# Altium project Field_control.PrjPcb
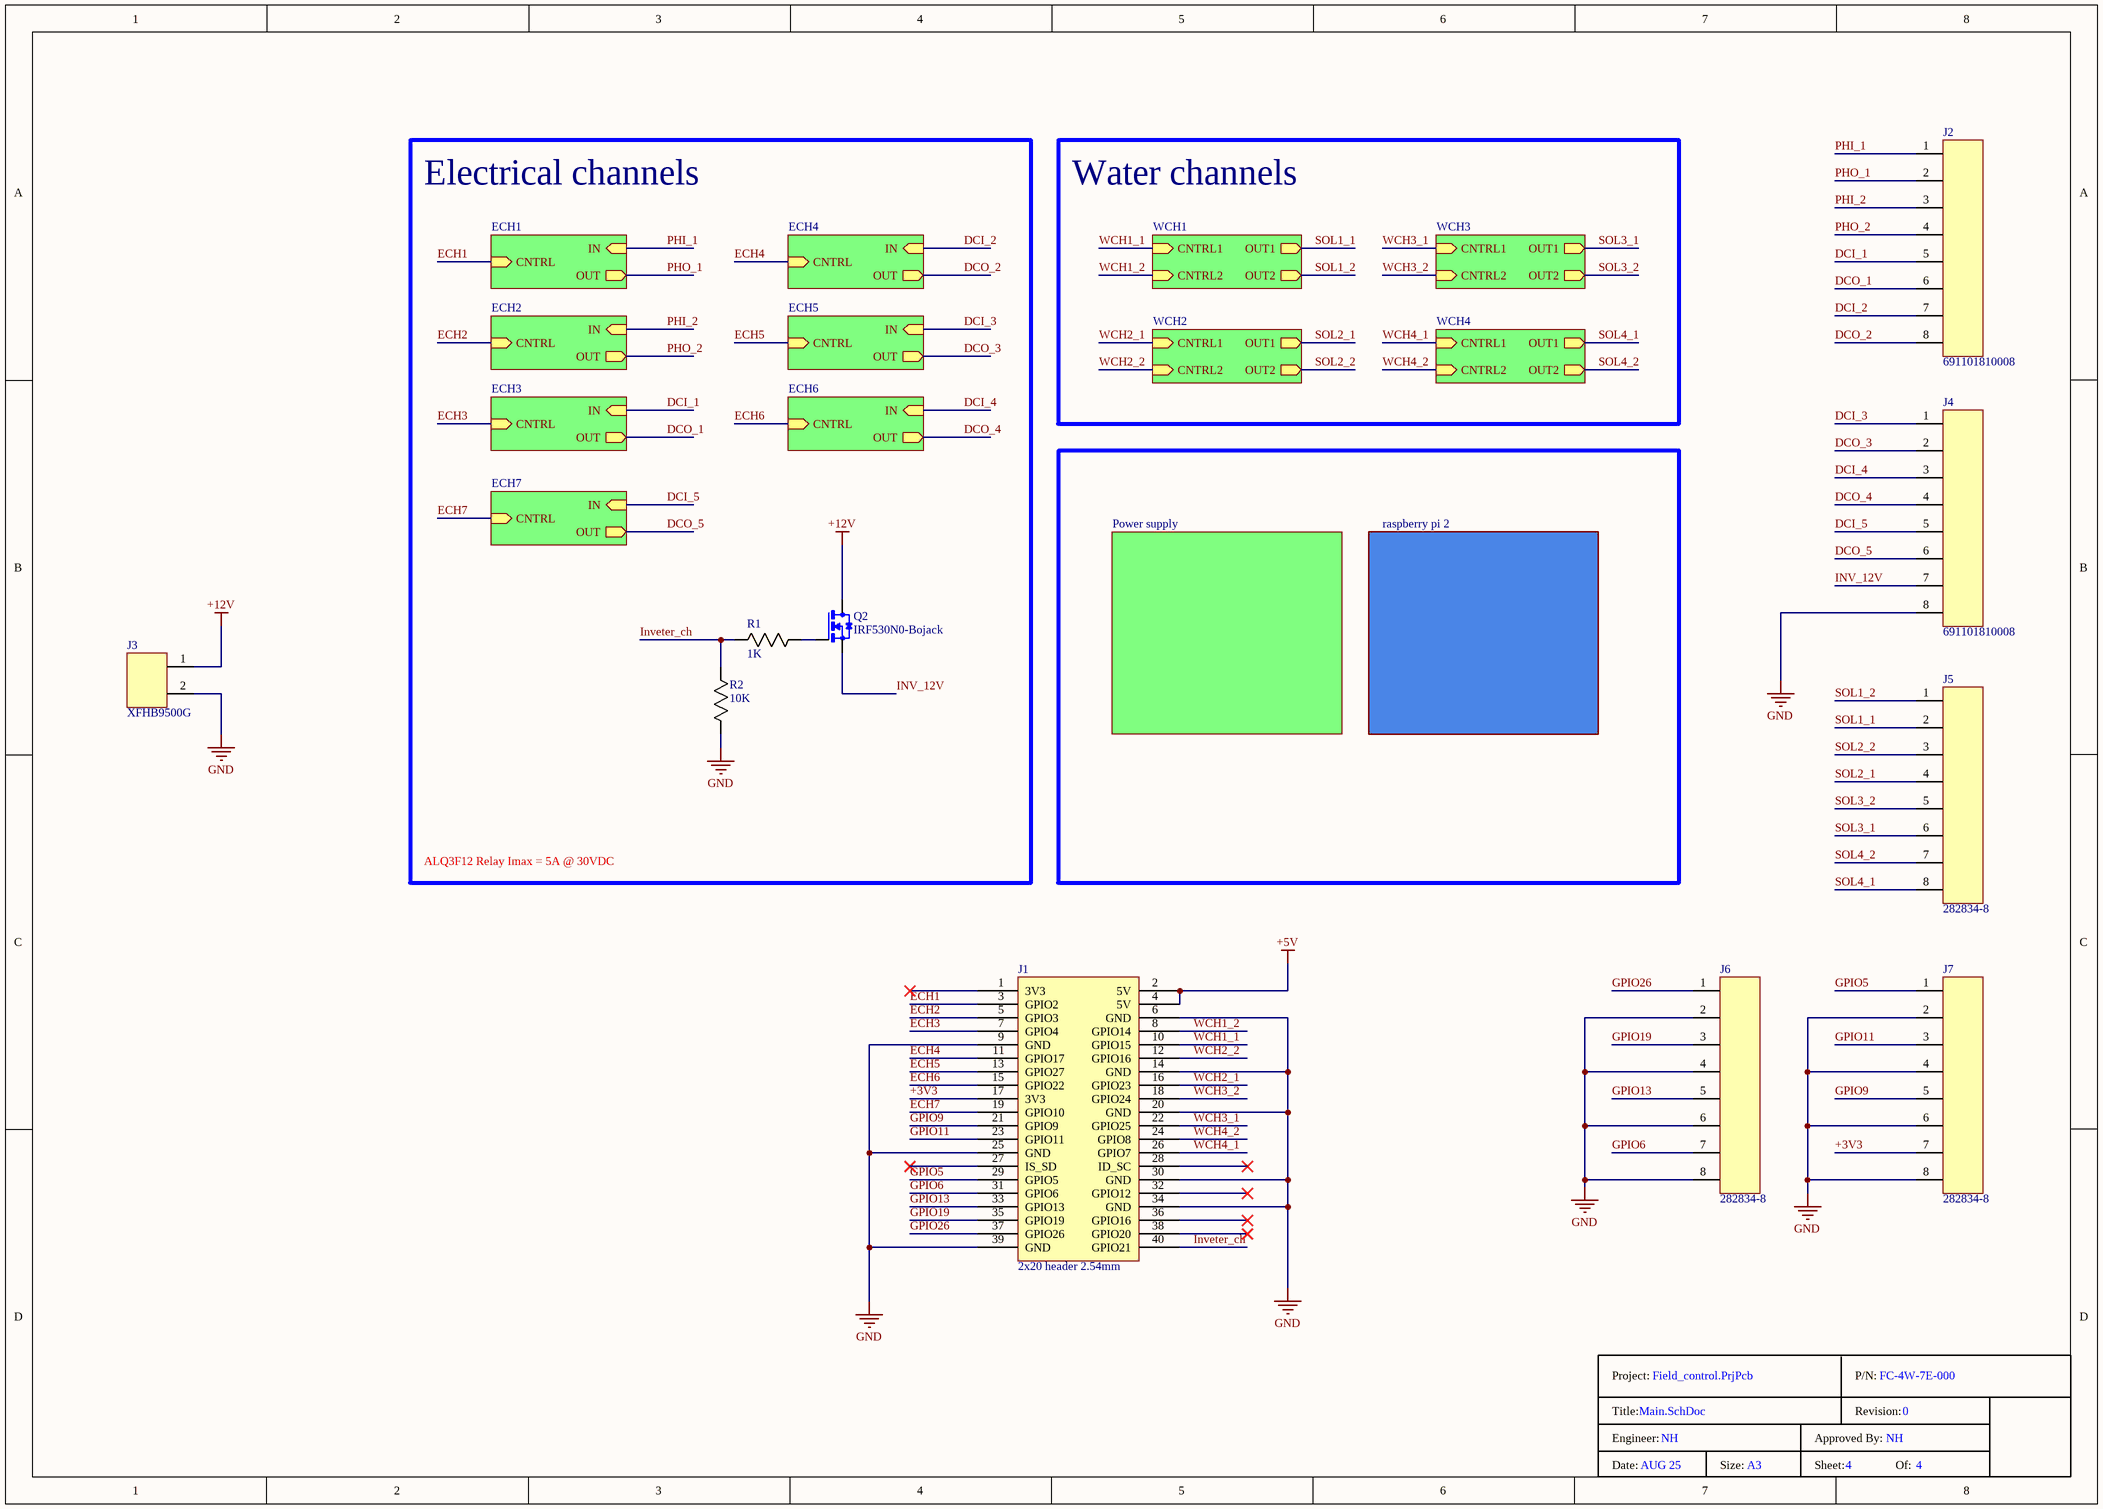
[diagram p0: Main.SchDoc]
AP: NH; PN: FC-4W-7E-000; REV: 0; SIZE: A3
4 sheets, 95 parts. Net scope: hierarchical (ports join the sheet entries above them; power ports are global).
Board file: PCB1.PcbDoc
Sheets:
  Main.SchDoc
    Power supply = PS.SchDoc
    ECH3 = Electrical Channels.SchDoc
    ECH2 = Electrical Channels.SchDoc
    ECH1 = Electrical Channels.SchDoc
    ECH4 = Electrical Channels.SchDoc
    ECH5 = Electrical Channels.SchDoc
    ECH6 = Electrical Channels.SchDoc
    WCH1 = Water Channel.SchDoc
    WCH2 = Water Channel.SchDoc
    WCH3 = Water Channel.SchDoc
    WCH4 = Water Channel.SchDoc
    ECH7 = Electrical Channels.SchDoc

## Sheet Main.SchDoc
size A3; Date: AUG 25; Engineer: NH; SheetNumber: 1; SheetTotal: 4

### Parts
(Parts that share a designator on the sheet are numbered #1, #2 ... from top to bottom, then left to right.)
*#1  Title Block  (value not drawn)  (graphical)
J1  2x20 header 2.54mm  [2x20 2.54mm header]
J2  691101810008  [691101810008]
J3  XFHB9500G  [XHFB9500G]
J4  691101810008  [691101810008]
J5  282834-8  [282834-8]
J6  282834-8  [282834-8]
J7  282834-8  [282834-8]
Q2  IRF530N0-Bojack  [SOT78(TO220AB)]
R1  1K  [R0603]
R2  10K  [R0603]
U3  raspberry pi 2  [Raspberry pi 2]  (mechanical)

### Blocks framed on the sheet
Electrical channels: Q2 R1 R2

### Sub-sheets
ECH1 = Electrical Channels.SchDoc: CNTRL (in), IN (in), OUT (out)
ECH2 = Electrical Channels.SchDoc: CNTRL (in), IN (in), OUT (out)
ECH3 = Electrical Channels.SchDoc: CNTRL (in), IN (in), OUT (out)
ECH4 = Electrical Channels.SchDoc: CNTRL (in), IN (in), OUT (out)
ECH5 = Electrical Channels.SchDoc: CNTRL (in), IN (in), OUT (out)
ECH6 = Electrical Channels.SchDoc: CNTRL (in), IN (in), OUT (out)
ECH7 = Electrical Channels.SchDoc: CNTRL (in), IN (in), OUT (out)
Power supply = PS.SchDoc: no entries
WCH1 = Water Channel.SchDoc: CNTRL1 (in), CNTRL2 (in), OUT1 (out), OUT2 (out)
WCH2 = Water Channel.SchDoc: CNTRL1 (in), CNTRL2 (in), OUT1 (out), OUT2 (out)
WCH3 = Water Channel.SchDoc: CNTRL1 (in), CNTRL2 (in), OUT1 (out), OUT2 (out)
WCH4 = Water Channel.SchDoc: CNTRL1 (in), CNTRL2 (in), OUT1 (out), OUT2 (out)

### Nets
+5V: J1.2(5V) J1.4(5V)
+12V: J3.1 Q2.3(D)
GND: J1.6(GND) J1.9(GND) J1.14(GND) J1.20(GND) J1.25(GND) J1.30(GND) J1.34(GND) J1.39(GND) J3.2 J4.8 J6.2 J6.4 J6.6 J6.8 J7.2 J7.4 J7.6 J7.8 R2.1
+3V3: J1.17(3V3) J7.7
DCI_1: J2.5 ; sheet ECH3/IN
DCI_2: J2.7 ; sheet ECH4/IN
DCI_3: J4.1 ; sheet ECH5/IN
DCI_4: J4.3 ; sheet ECH6/IN
DCI_5: J4.5 ; sheet ECH7/IN
DCO_1: J2.6 ; sheet ECH3/OUT
DCO_2: J2.8 ; sheet ECH4/OUT
DCO_3: J4.2 ; sheet ECH5/OUT
DCO_4: J4.4 ; sheet ECH6/OUT
DCO_5: J4.6 ; sheet ECH7/OUT
ECH1: J1.3(GPIO2) ; sheet ECH1/CNTRL
ECH2: J1.5(GPIO3) ; sheet ECH2/CNTRL
ECH3: J1.7(GPIO4) ; sheet ECH3/CNTRL
ECH4: J1.11(GPIO17) ; sheet ECH4/CNTRL
ECH5: J1.13(GPIO27) ; sheet ECH5/CNTRL
ECH6: J1.15(GPIO22) ; sheet ECH6/CNTRL
ECH7: J1.19(GPIO10) ; sheet ECH7/CNTRL
GPIO5: J1.29(GPIO5) J7.1
GPIO6: J1.31(GPIO6) J6.7
GPIO9: J1.21(GPIO9) J7.5
GPIO11: J1.23(GPIO11) J7.3
GPIO13: J1.33(GPIO13) J6.5
GPIO19: J1.35(GPIO19) J6.3
GPIO26: J1.37(GPIO26) J6.1
INV_12V: J4.7 Q2.2(S)
Inveter_ch: J1.40(GPIO21) R1.1 R2.2
PHI_1: J2.1 ; sheet ECH1/IN
PHI_2: J2.3 ; sheet ECH2/IN
PHO_1: J2.2 ; sheet ECH1/OUT
PHO_2: J2.4 ; sheet ECH2/OUT
SOL1_1: J5.2 ; sheet WCH1/OUT1
SOL1_2: J5.1 ; sheet WCH1/OUT2
SOL2_1: J5.4 ; sheet WCH2/OUT1
SOL2_2: J5.3 ; sheet WCH2/OUT2
SOL3_1: J5.6 ; sheet WCH3/OUT1
SOL3_2: J5.5 ; sheet WCH3/OUT2
SOL4_1: J5.8 ; sheet WCH4/OUT1
SOL4_2: J5.7 ; sheet WCH4/OUT2
WCH1_1: J1.10(GPIO15) ; sheet WCH1/CNTRL1
WCH1_2: J1.8(GPIO14) ; sheet WCH1/CNTRL2
WCH2_1: J1.16(GPIO23) ; sheet WCH2/CNTRL1
WCH2_2: J1.12(GPIO16) ; sheet WCH2/CNTRL2
WCH3_1: J1.22(GPIO25) ; sheet WCH3/CNTRL1
WCH3_2: J1.18(GPIO24) ; sheet WCH3/CNTRL2
WCH4_1: J1.26(GPIO7) ; sheet WCH4/CNTRL1
WCH4_2: J1.24(GPIO8) ; sheet WCH4/CNTRL2
NetQ2_1: Q2.1(G) R1.2

Not connected (* = marked no-connect by the designer): J1 1(3V3)* 27(IS_SD)* 28(ID_SC)* 32(GPIO12)* 36(GPIO16)* 38(GPIO20)*

### Notes on the sheet
- Water channels
- ALQ3F12 Relay Imax = 5A @ 30VDC
- (in symbol Title Block) Project:; P/N:; Title:; Revision:; Engineer:; Approved By:; Date:; Size:; Sheet:; Of:

### Library data of the parts
*#1 = Title Block: Hatokay DSL&P Titile Block
J2 J4 = 691101810008: 8 Position Wire to Board Terminal Block Horizontal with Board 0.394" (10.00mm) Through Hole; Manufacturer: Würth Elektronik; Manufacturer P/N: 691101810008
J3 = XFHB9500G: Manufacturer: XF; Manufacturer P/N: XFHB9500G
J5-J7 = 282834-8: TERM BLK 8P SIDE ENT 2.54MM PCB; Manufacturer: TE Connectivity AMP Connectors; Manufacturer P/N: 282834-8
Q2 = IRF530N0-Bojack: MOSFET N-CH 100V 17A TO220AB; Manufacturer: Infineon Technologies; Manufacturer P/N: IRF530N0
R1 = RMCF0603FT1K00: Manufacturer: Stackpole Electronics Inc; Manufacturer P/N: RMCF0603FT1K00
R2 = RMCF0603FT10K0: Manufacturer: Stackpole Electronics Inc; Manufacturer P/N: RMCF0603FT10K0

## Sheet PS.SchDoc
size A; Engineer: NH; SheetNumber: 4; SheetTotal: 4
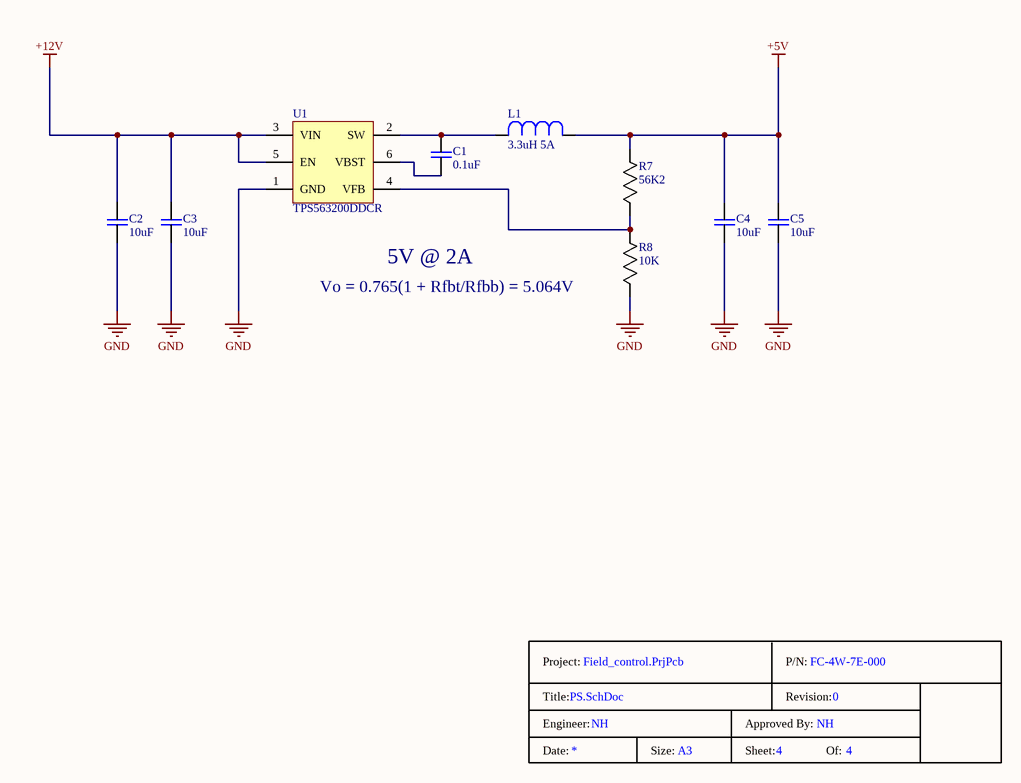
[diagram p1: PS.SchDoc]

### Parts
(Parts that share a designator on the sheet are numbered #1, #2 ... from top to bottom, then left to right.)
*#2  Tital_block_1  (value not drawn)  (graphical)
C1  0.1uF  [C0603]
C2  10uF  [C1206]
C3  10uF  [C1206]
C4  10uF  [C0603]
C5  10uF  [C0603]
L1  3.3uH 5A  [IHLP2020CZER3R3M01]
R7  56K2  [R0603]
R8  10K  [R0603]
U1  TPS563200DDCR  [TI-SOT23]

### Nets
+5V: C4.2 C5.2 L1.1 R7.2
+12V: C2.2 C3.2 U1.3(VIN) U1.5(EN)
GND: C2.1 C3.1 C4.1 C5.1 R8.1 U1.1(GND)
NetC1_1: C1.1 U1.6(VBST)
NetC1_2: C1.2 L1.2 U1.2(SW)
NetR7_1: R7.1 R8.2 U1.4(VFB)

### Notes on the sheet
- 5V @ 2A
- (near R8) Vo = 0.765(1 + Rfbt/Rfbb) = 5.064V
- (in symbol Tital_block_1) Project:; P/N:; Title:; Revision:; Engineer:; Approved By:; Date:; Size:; Sheet:; Of:

### Library data of the parts
C1 = KGM15BR71E104KT: CAP CER 0.1UF 25V X7R 0603; Manufacturer: KYOCERA AVX; Manufacturer P/N: KGM15BR71E104KT
C2 C3 = CL31A106KBHNNNE: CAP CER 10UF 50V X5R 1206; Manufacturer: Samsung Electro-Mechanics; Manufacturer P/N: CL31A106KBHNNNE
C4 C5 = CC0603MRX5R6BB106: CAP CER 10UF 10V X5R 0603; Manufacturer: YAGEO; Manufacturer P/N: CC0603MRX5R6BB106
L1 = IHLP2020CZER3R3M01: Manufacturer: Vishay Dale; Manufacturer P/N: IHLP2020CZER3R3M01
R7 = RC0603FR-0756K2L: RES 56.2K OHM 1% 1/10W 0603; Manufacturer: YAGEO; Manufacturer P/N: RC0603FR-0756K2L
R8 = RMCF0603FT10K0: Manufacturer: Stackpole Electronics Inc; Manufacturer P/N: RMCF0603FT10K0
U1 = TPS563200DDCR: IC REG BUCK ADJ 3A SOT23; Manufacturer: Texas Instruments; Manufacturer P/N: TPS563200DDCR

## Sheet Electrical Channels.SchDoc
size A; Engineer: NH; SheetNumber: 3; SheetTotal: 4
Used 7 times, as channels ECH3, ECH2, ECH1, ECH4, ECH5, ECH6, ECH7. Parts and nets are listed once, with the designators drawn on the sheet.
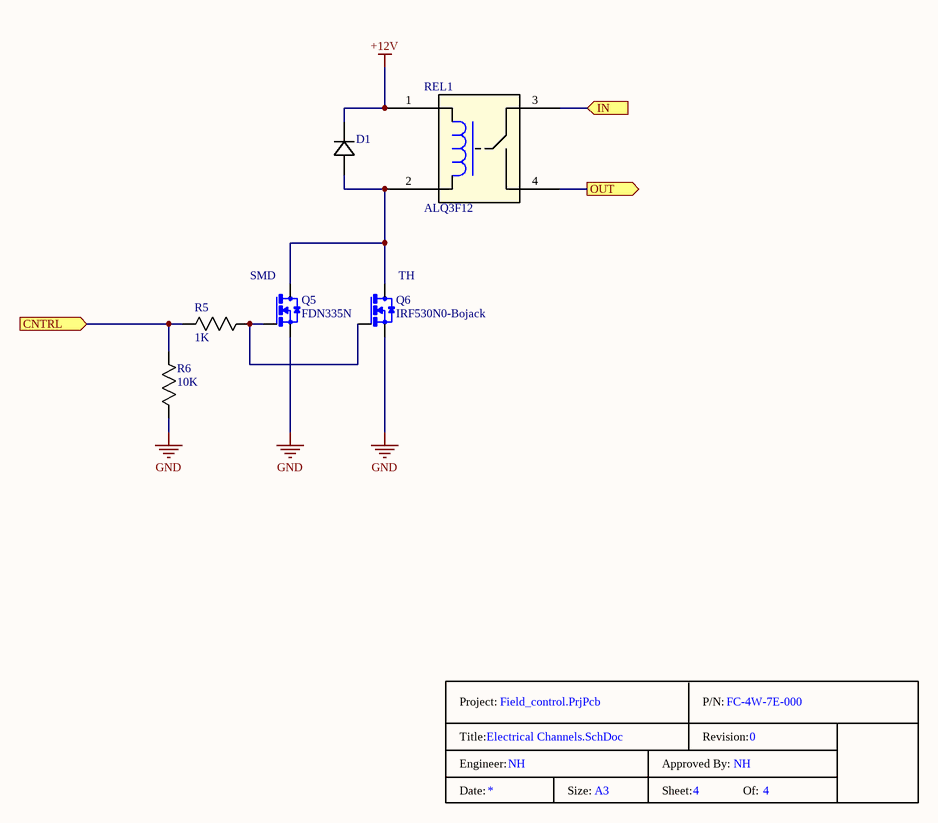
[diagram p2: Electrical Channels.SchDoc]

### Parts
*  Tital_block_1  (value not drawn)  (graphical)
D1  1N5392  [PCBComponent_1]  (value not drawn)
Q5  FDN335N  [ON-SEMI SOT 23]
Q6  IRF530N0-Bojack  [SOT78(TO220AB)]
R5  1K  [R0603]
R6  10K  [R0603]
REL1  ALQ3F12  [ALQ3F12]

### Ports
CNTRL (in), IN (in), OUT (out)

### Nets
+12V: D1.1(C) REL1.1
GND: Q5.2(S) Q6.2(S) R6.1
CNTRL: R5.1 R6.2 ; port CNTRL
IN: REL1.3 ; port IN
OUT: REL1.4 ; port OUT
NetD1_2: D1.2(A) Q5.3(D) Q6.3(D) REL1.2
NetQ5_1: Q5.1(G) Q6.1(G) R5.2

### Channels
ECH3: designators end in _ECH3; ports CNTRL=ECH3 IN=DCI_1 OUT=DCO_1
ECH2: designators end in _ECH2; ports CNTRL=ECH2 IN=PHI_2 OUT=PHO_2
ECH1: designators end in _ECH1; ports CNTRL=ECH1 IN=PHI_1 OUT=PHO_1
ECH4: designators end in _ECH4; ports CNTRL=ECH4 IN=DCI_2 OUT=DCO_2
ECH5: designators end in _ECH5; ports CNTRL=ECH5 IN=DCI_3 OUT=DCO_3
ECH6: designators end in _ECH6; ports CNTRL=ECH6 IN=DCI_4 OUT=DCO_4
ECH7: designators end in _ECH7; ports CNTRL=ECH7 IN=DCI_5 OUT=DCO_5

### Notes on the sheet
- (near Q5) SMD
- (near Q6) TH
- (in symbol Tital_block_1) Project:; P/N:; Title:; Revision:; Engineer:; Approved By:; Date:; Size:; Sheet:; Of:

### Library data of the parts
D1 = 1N5392: DIODE STANDARD 100V 1.5A DO204AL; Manufacturer: Vishay General Semiconductor - Diodes Division; Manufacturer P/N: 1N5392-E3/54
Q5 = FDN335N: MOSFET N-CH 20V 1.7A SUPERSOT3; Manufacturer: onsemi; Manufacturer P/N: FDN335N
Q6 = IRF530N0-Bojack: MOSFET N-CH 100V 17A TO220AB; Manufacturer: Bojack; Manufacturer P/N: IRF530N0
R5 = RMCF0603FT1K00: Manufacturer: Stackpole Electronics Inc; Manufacturer P/N: RMCF0603FT1K00
R6 = RMCF0603FT10K0: Manufacturer: Stackpole Electronics Inc; Manufacturer P/N: RMCF0603FT10K0
REL1 = ALQ3F12: Manufacturer: Panasonic Electric Works; ComponentLink1Description: New link; ComponentLink1URL: *; Manufacturer P/N: ALQ3F12

## Sheet Water Channel.SchDoc
size A; Engineer: NH; SheetNumber: 2; SheetTotal: 4
Used 4 times, as channels WCH1, WCH2, WCH3, WCH4. Parts and nets are listed once, with the designators drawn on the sheet.
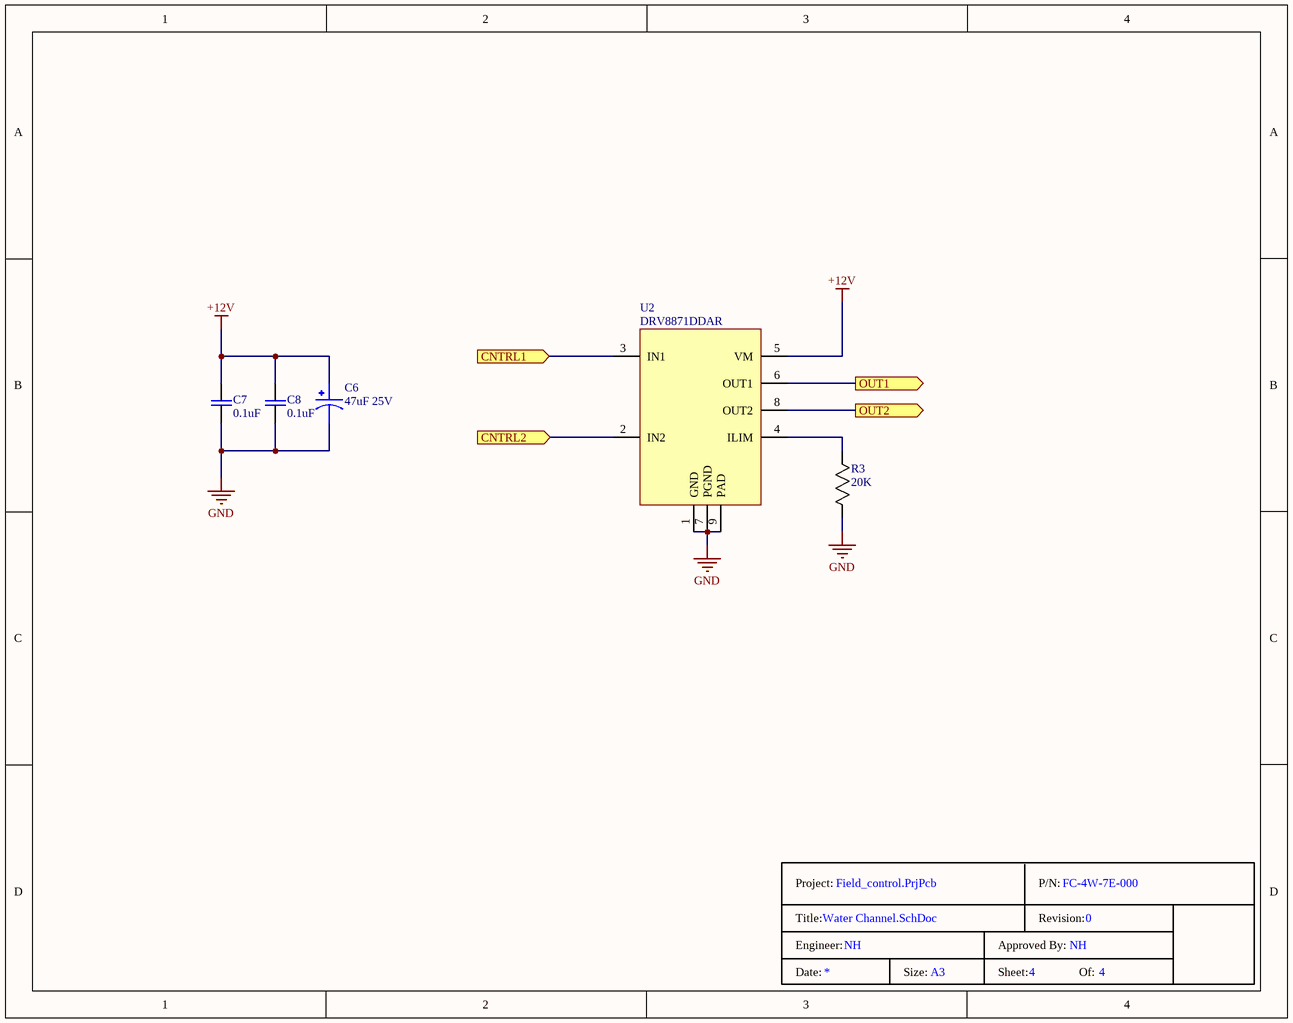
[diagram p3: Water Channel.SchDoc]

### Parts
*  Tital_block_1  (value not drawn)  (graphical)
C6  47uF 25V  [A768EB476M1ELAE042]
C7  0.1uF  [C0603]
C8  0.1uF  [C0603]
R3  20K  [R0603]
U2  DRV8871DDAR  [TI-8-SO PowerPad]

### Ports
CNTRL1 (in), CNTRL2 (in), OUT1 (out), OUT2 (out)

### Nets
+12V: C6.1 C7.2 C8.2 U2.5(VM)
GND: C6.2 C7.1 C8.1 R3.1 U2.1(GND) U2.7(PGND) U2.9(PAD)
CNTRL1: U2.3(IN1) ; port CNTRL1
CNTRL2: U2.2(IN2) ; port CNTRL2
OUT1: U2.6(OUT1) ; port OUT1
OUT2: U2.8(OUT2) ; port OUT2
NetR3_2: R3.2 U2.4(ILIM)

### Channels
WCH1: designators end in _WCH1; ports CNTRL1=WCH1_1 CNTRL2=WCH1_2 OUT1=SOL1_1 OUT2=SOL1_2
WCH2: designators end in _WCH2; ports CNTRL1=WCH2_1 CNTRL2=WCH2_2 OUT1=SOL2_1 OUT2=SOL2_2
WCH3: designators end in _WCH3; ports CNTRL1=WCH3_1 CNTRL2=WCH3_2 OUT1=SOL3_1 OUT2=SOL3_2
WCH4: designators end in _WCH4; ports CNTRL1=WCH4_1 CNTRL2=WCH4_2 OUT1=SOL4_1 OUT2=SOL4_2

### Notes on the sheet
- (in symbol Tital_block_1) Project:; P/N:; Title:; Revision:; Engineer:; Approved By:; Date:; Size:; Sheet:; Of:

### Library data of the parts
C6 = A768EB476M1ELAE042: CAP ALUM POLY 47UF 20% 25V SMD; Manufacturer: KEMET; Manufacturer P/N: A768EB476M1ELAE042
C7 C8 = C0603C104K5RECAUTO: CAP CER 0.10UF 50V X7R 0603; Manufacturer: KEMET; Manufacturer P/N: C0603C104K5RECAUTO
R3 = RC0603FR-0730KL: RES 30K OHM 1% 1/10W 0603; Manufacturer: YAGEO; Manufacturer P/N: RC0603FR-0730KL
U2 = DRV8871DDAR: Unipolar Motor Driver NMOS PWM 8-SO PowerPad; Manufacturer: Texas Instruments; Manufacturer P/N: DRV8871DDAR

## Nets that join several sheets
+5V: Main (J1.2 J1.4), PS (C4.2 C5.2 L1.1 R7.2)
+12V: Main (J3.1 Q2.3), PS (C2.2 C3.2 U1.3 U1.5), ECH3 (D1_ECH3.1 REL1_ECH3.1), ECH2 (D1_ECH2.1 REL1_ECH2.1), ECH1 (D1_ECH1.1 REL1_ECH1.1), ECH4 (D1_ECH4.1 REL1_ECH4.1), ECH5 (D1_ECH5.1 REL1_ECH5.1), ECH6 (D1_ECH6.1 REL1_ECH6.1), WCH1 (C6_WCH1.1 C7_WCH1.2 C8_WCH1.2 U2_WCH1.5), WCH2 (C6_WCH2.1 C7_WCH2.2 C8_WCH2.2 U2_WCH2.5), WCH3 (C6_WCH3.1 C7_WCH3.2 C8_WCH3.2 U2_WCH3.5), WCH4 (C6_WCH4.1 C7_WCH4.2 C8_WCH4.2 U2_WCH4.5), ECH7 (D1_ECH7.1 REL1_ECH7.1)
GND: Main (19 pins), PS (6 pins), ECH3 (Q5_ECH3.2 Q6_ECH3.2 R6_ECH3.1), ECH2 (Q5_ECH2.2 Q6_ECH2.2 R6_ECH2.1), ECH1 (Q5_ECH1.2 Q6_ECH1.2 R6_ECH1.1), ECH4 (Q5_ECH4.2 Q6_ECH4.2 R6_ECH4.1), ECH5 (Q5_ECH5.2 Q6_ECH5.2 R6_ECH5.1), ECH6 (Q5_ECH6.2 Q6_ECH6.2 R6_ECH6.1), WCH1 (7 pins), WCH2 (7 pins), WCH3 (7 pins), WCH4 (7 pins), ECH7 (Q5_ECH7.2 Q6_ECH7.2 R6_ECH7.1)
DCI_1: Main (J2.5), ECH3 (REL1_ECH3.3)
DCI_2: Main (J2.7), ECH4 (REL1_ECH4.3)
DCI_3: Main (J4.1), ECH5 (REL1_ECH5.3)
DCI_4: Main (J4.3), ECH6 (REL1_ECH6.3)
DCI_5: Main (J4.5), ECH7 (REL1_ECH7.3)
DCO_1: Main (J2.6), ECH3 (REL1_ECH3.4)
DCO_2: Main (J2.8), ECH4 (REL1_ECH4.4)
DCO_3: Main (J4.2), ECH5 (REL1_ECH5.4)
DCO_4: Main (J4.4), ECH6 (REL1_ECH6.4)
DCO_5: Main (J4.6), ECH7 (REL1_ECH7.4)
ECH1: Main (J1.3), ECH1 (R5_ECH1.1 R6_ECH1.2)
ECH2: Main (J1.5), ECH2 (R5_ECH2.1 R6_ECH2.2)
ECH3: Main (J1.7), ECH3 (R5_ECH3.1 R6_ECH3.2)
ECH4: Main (J1.11), ECH4 (R5_ECH4.1 R6_ECH4.2)
ECH5: Main (J1.13), ECH5 (R5_ECH5.1 R6_ECH5.2)
ECH6: Main (J1.15), ECH6 (R5_ECH6.1 R6_ECH6.2)
ECH7: Main (J1.19), ECH7 (R5_ECH7.1 R6_ECH7.2)
PHI_1: Main (J2.1), ECH1 (REL1_ECH1.3)
PHI_2: Main (J2.3), ECH2 (REL1_ECH2.3)
PHO_1: Main (J2.2), ECH1 (REL1_ECH1.4)
PHO_2: Main (J2.4), ECH2 (REL1_ECH2.4)
SOL1_1: Main (J5.2), WCH1 (U2_WCH1.6)
SOL1_2: Main (J5.1), WCH1 (U2_WCH1.8)
SOL2_1: Main (J5.4), WCH2 (U2_WCH2.6)
SOL2_2: Main (J5.3), WCH2 (U2_WCH2.8)
SOL3_1: Main (J5.6), WCH3 (U2_WCH3.6)
SOL3_2: Main (J5.5), WCH3 (U2_WCH3.8)
SOL4_1: Main (J5.8), WCH4 (U2_WCH4.6)
SOL4_2: Main (J5.7), WCH4 (U2_WCH4.8)
WCH1_1: Main (J1.10), WCH1 (U2_WCH1.3)
WCH1_2: Main (J1.8), WCH1 (U2_WCH1.2)
WCH2_1: Main (J1.16), WCH2 (U2_WCH2.3)
WCH2_2: Main (J1.12), WCH2 (U2_WCH2.2)
WCH3_1: Main (J1.22), WCH3 (U2_WCH3.3)
WCH3_2: Main (J1.18), WCH3 (U2_WCH3.2)
WCH4_1: Main (J1.26), WCH4 (U2_WCH4.3)
WCH4_2: Main (J1.24), WCH4 (U2_WCH4.2)

## Assembly variants
Populated: not fitted J1 Q6_ECH1 Q6_ECH2 Q6_ECH3 Q6_ECH4 Q6_ECH5 Q6_ECH6 Q6_ECH7 U3
JLC_PCB: not fitted D1_ECH1 D1_ECH2 D1_ECH3 D1_ECH4 D1_ECH5 D1_ECH6 D1_ECH7 J1 J2 J3 J4 J5 J6 J7 Q6_ECH1 Q6_ECH2 Q6_ECH3 Q6_ECH4 Q6_ECH5 Q6_ECH6 Q6_ECH7 REL1_ECH1 REL1_ECH2 REL1_ECH3 REL1_ECH4 REL1_ECH5 REL1_ECH6 REL1_ECH7